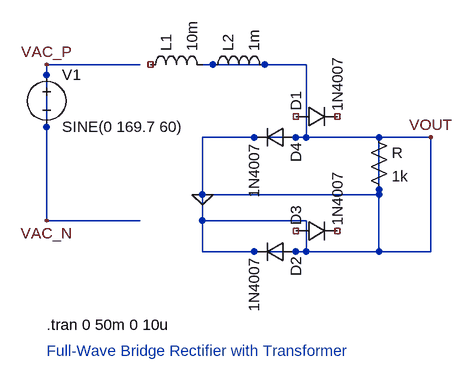
[diagram p0: schematic 05_circuit_generated-by-claude-sonnet-4-6.asc]
05_circuit_generated-by-claude-sonnet-4-6.asc, the LTspice schematic file:
Version 4
SHEET 1 880 680
WIRE 48 80 48 320
WIRE 48 80 192 80
WIRE 48 320 192 320
WIRE 288 80 448 80
WIRE 288 320 448 320
WIRE 448 80 448 192
WIRE 448 320 448 368
WIRE 288 192 448 192
WIRE 288 368 448 368
WIRE 288 192 288 368
WIRE 448 192 640 192
WIRE 640 192 640 368
WIRE 640 368 448 368
WIRE 560 192 560 368
WIRE 288 280 560 280
FLAG 288 280 0
FLAG 640 192 VOUT
FLAG 48 80 VAC_P
FLAG 48 320 VAC_N
SYMBOL voltage 48 80 R0
SYMATTR InstName V1
SYMATTR Value SINE(0 169.7 60)
SYMBOL ind 192 96 R270
SYMATTR InstName L1
SYMATTR Value 10m
SYMATTR SpiceLine Rser=0.1
SYMBOL ind 288 96 R270
SYMATTR InstName L2
SYMATTR Value 1m
SYMATTR SpiceLine Rser=0.01
SYMBOL diode 432 176 R90
SYMATTR InstName D4
SYMATTR Value 1N4007
SYMBOL diode 432 176 R270
SYMATTR InstName D1
SYMATTR Value 1N4007
SYMBOL diode 432 352 R90
SYMATTR InstName D2
SYMATTR Value 1N4007
SYMBOL diode 432 352 R270
SYMATTR InstName D3
SYMATTR Value 1N4007
SYMBOL res 544 176 R0
SYMATTR InstName R
SYMATTR Value 1k
TEXT 48 480 Left 2 !.tran 0 50m 0 10u
TEXT 48 520 Left 2 ;Full-Wave Bridge Rectifier with Transformer

The netlist it stands for:
* 05_circuit_generated-by-claude-sonnet-4-6.asc
V1 VAC_N VAC_N SINE(0 169.7 60)
L1 NC_01 0 10m Rser=0.1
L2 0 0 1m Rser=0.01
D4 0 0 1N4007
D1 NC_02 NC_03 1N4007
D2 0 0 1N4007
D3 NC_04 NC_05 1N4007
R 0 0 1k
.model D D
.lib standard.dio
.tran 0 50m 0 10u
* Full-Wave Bridge Rectifier with Transformer
.backanno
.end